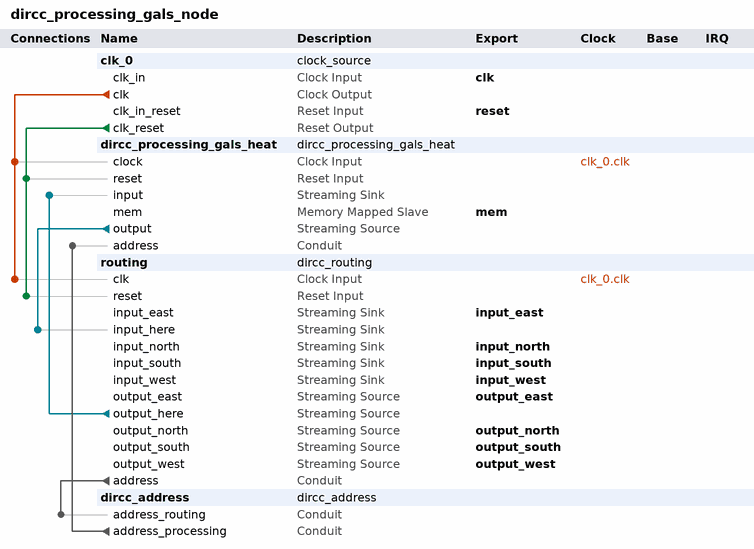
[diagram p0: system contents]
# Platform Designer (Qsys) system dircc_processing_gals_node, Cyclone V 5CSEMA5F31C6
# Parameters at their usual value, and those the tool derives, are not listed.
package require -exact qsys 16.1
create_system dircc_processing_gals_node
set_project_property DEVICE_FAMILY {Cyclone V}
set_project_property DEVICE 5CSEMA5F31C6

add_instance clk_0 clock_source 16.1
set_instance_parameter_value clk_0 clockFrequency 50000000

add_instance dircc_processing_gals_heat dircc_processing_gals_heat 1.0
set_instance_parameter_value dircc_processing_gals_heat ADDRESS_MEM_WIDTH 32
set_instance_parameter_value dircc_processing_gals_heat BITS_PER_SYMBOL 8
set_instance_parameter_value dircc_processing_gals_heat DEVICE_ID 0
set_instance_parameter_value dircc_processing_gals_heat DIRCC_RTS_FLAGS_COMPUTE 2147483648
set_instance_parameter_value dircc_processing_gals_heat INPUT_FIFO_DEPTH 8
set_instance_parameter_value dircc_processing_gals_heat RTS_READY_WIDTH 32
set_instance_parameter_value dircc_processing_gals_heat STATUS_ADDRESS_WIDTH 15
set_instance_parameter_value dircc_processing_gals_heat STATUS_BYTE_WIDTH 8
set_instance_parameter_value dircc_processing_gals_heat STATUS_DEV_MEM_WIDTH 12
set_instance_parameter_value dircc_processing_gals_heat STATUS_EDGE_MEM_WIDTH 12
set_instance_parameter_value dircc_processing_gals_heat STATUS_MEM_WIDTH 16
set_instance_parameter_value dircc_processing_gals_heat SYMBOLS_PER_BEAT 4

add_instance routing dircc_routing 1.0

add_instance dircc_address dircc_address 1.0
set_instance_parameter_value dircc_address ADDRESS 0

# connections
add_connection clk_0.clk dircc_processing_gals_heat.clock clock
add_connection clk_0.clk routing.clk clock
add_connection clk_0.clk_reset dircc_processing_gals_heat.reset reset
add_connection clk_0.clk_reset routing.reset reset
add_connection dircc_processing_gals_heat.output routing.input_here avalon_streaming
add_connection routing.output_here dircc_processing_gals_heat.input avalon_streaming
add_connection dircc_address.address_processing dircc_processing_gals_heat.address conduit
add_connection routing.address dircc_address.address_routing conduit

# exported interfaces
add_interface clk clock sink
set_interface_property clk EXPORT_OF clk_0.clk_in
add_interface input_east avalon_streaming sink
set_interface_property input_east EXPORT_OF routing.input_east
add_interface input_north avalon_streaming sink
set_interface_property input_north EXPORT_OF routing.input_north
add_interface input_south avalon_streaming sink
set_interface_property input_south EXPORT_OF routing.input_south
add_interface input_west avalon_streaming sink
set_interface_property input_west EXPORT_OF routing.input_west
add_interface mem avalon slave
set_interface_property mem EXPORT_OF dircc_processing_gals_heat.mem
add_interface output_east avalon_streaming source
set_interface_property output_east EXPORT_OF routing.output_east
add_interface output_north avalon_streaming source
set_interface_property output_north EXPORT_OF routing.output_north
add_interface output_south avalon_streaming source
set_interface_property output_south EXPORT_OF routing.output_south
add_interface output_west avalon_streaming source
set_interface_property output_west EXPORT_OF routing.output_west
add_interface reset reset sink
set_interface_property reset EXPORT_OF clk_0.clk_in_reset

set_interconnect_requirement {$system} qsys_mm.clockCrossingAdapter HANDSHAKE
set_interconnect_requirement {$system} qsys_mm.enableEccProtection FALSE
set_interconnect_requirement {$system} qsys_mm.insertDefaultSlave FALSE
set_interconnect_requirement {$system} qsys_mm.maxAdditionalLatency 1

save_system dircc_processing_gals_node.qsys
